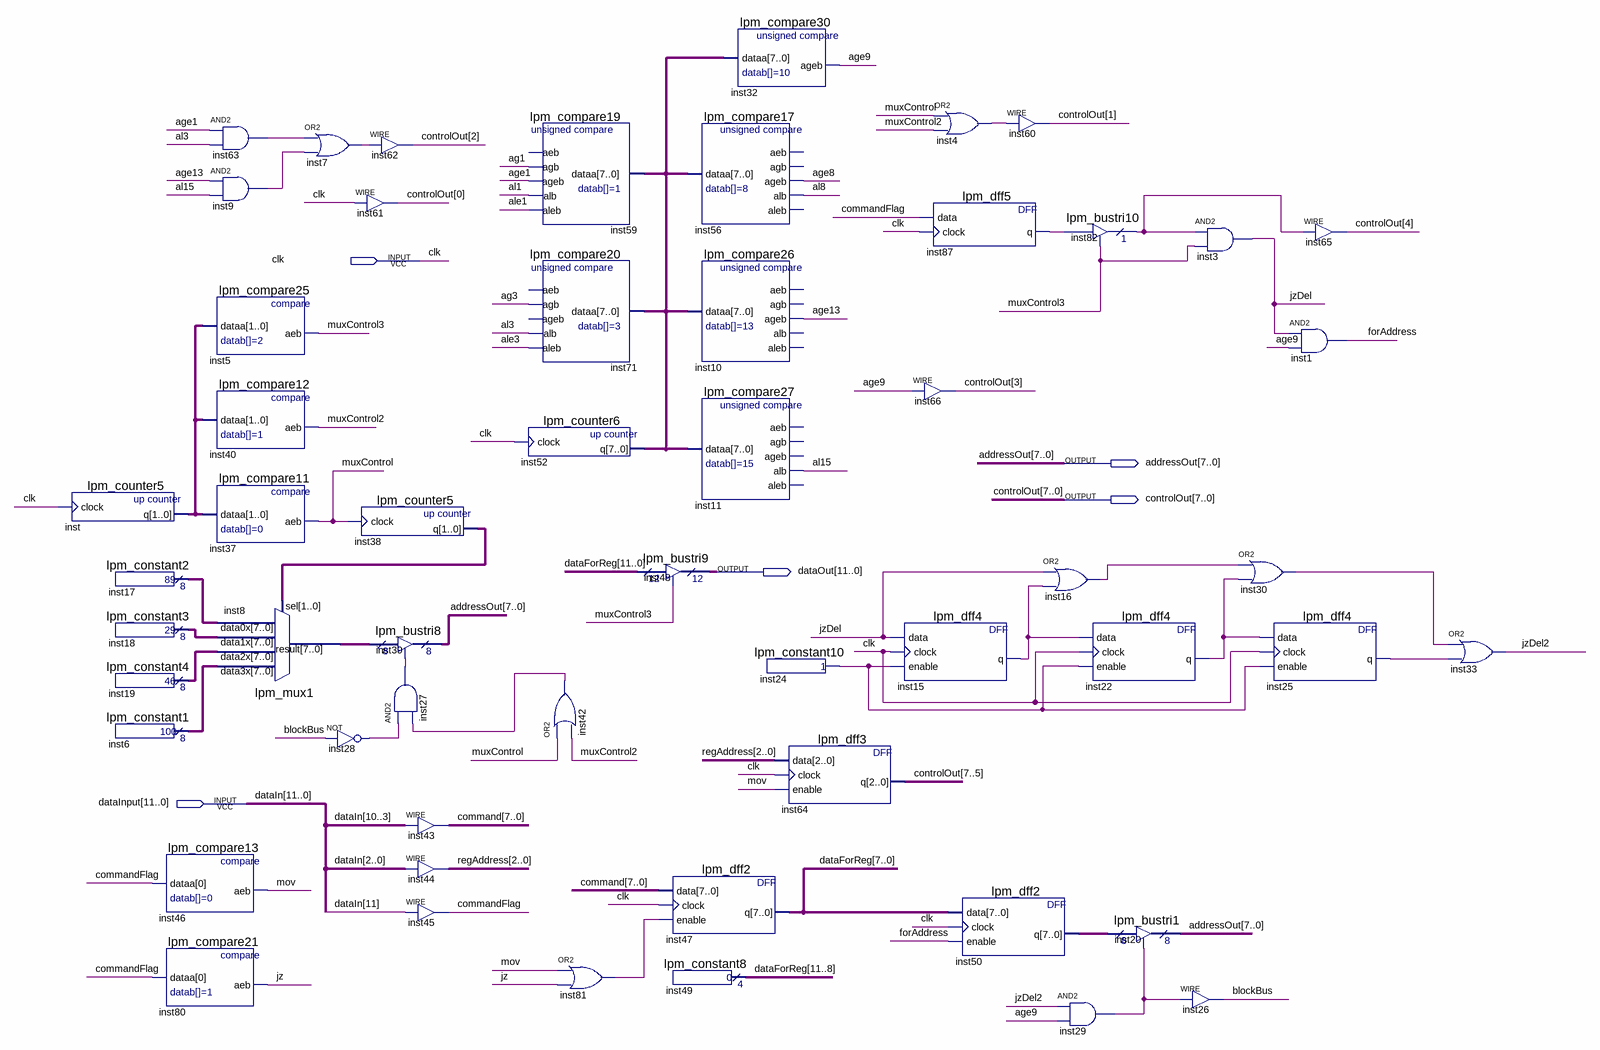
[diagram p0: schematic sheet]
// Quartus schematic ControlBlock.bdf as structural Verilog: 55 symbols, 5 pins
module ControlBlock (
  input  clk,
  input  [11:0] dataInput,
  output [7:0] addressOut,
  output [7:0] controlOut,
  output [11:0] dataOut
);

  wire ag1, ag3, age1, age8, age9, age13, al1, al3, al8, al15, ale1, ale3, blockBus, commandFlag, forAddress,
       inst4_out, inst7_out, inst9_out, inst15_q, inst16_out, inst22_q, inst24_result, inst25_q, inst27_out,
       inst28_out, inst29_out, inst30_out, inst42_out, inst63_out, inst81_out, inst82_tridata, inst87_q, jz,
       jzDel, jzDel2, mov, muxControl, muxControl2, muxControl3;
  wire [1:0] inst38_q, inst_q;
  wire [2:0] regAddress;
  wire [7:0] command, inst6_result, inst8_result, inst17_result, inst18_result, inst19_result, inst50_q,
       inst52_q;
  wire [11:0] dataForReg;

  lpm_counter5 inst (.clock(clk), .q(inst_q));
  lpm_constant2 inst17 (.result(inst17_result));
  lpm_constant3 inst18 (.result(inst18_result));
  lpm_constant4 inst19 (.result(inst19_result));
  lpm_constant1 inst6 (.result(inst6_result));
  lpm_compare13 inst46 (.dataa(commandFlag), .aeb(mov));
  lpm_compare21 inst80 (.dataa(commandFlag), .aeb(jz));
  and inst63 (inst63_out, age1, al3);
  and inst9 (inst9_out, age13, al15);
  lpm_compare25 inst5 (.dataa(inst_q), .aeb(muxControl3));
  lpm_compare12 inst40 (.dataa(inst_q), .aeb(muxControl2));
  lpm_compare11 inst37 (.dataa(inst_q), .aeb(muxControl));
  lpm_mux1 inst8 (
    .data3x(inst6_result), .data2x(inst19_result), .data1x(inst18_result), .data0x(inst17_result),
    .sel(inst38_q), .result(inst8_result));
  or inst7 (inst7_out, inst63_out, inst9_out);
  not inst28 (inst28_out, blockBus);
  assign controlOut[2] = inst7_out;  // WIRE inst62
  assign controlOut[0] = clk;  // WIRE inst61
  lpm_counter5 inst38 (.clock(muxControl), .q(inst38_q));
  lpm_bustri8 inst39 (.enabledt(inst27_out), .data(inst8_result), .tridata(addressOut));
  and inst27 (inst27_out, inst28_out, inst42_out);
  assign command = dataInput[10:3];  // WIRE inst43
  assign regAddress = dataInput[2:0];  // WIRE inst44
  assign commandFlag = dataInput[11];  // WIRE inst45
  lpm_compare19 inst59 (.dataa(inst52_q), .agb(ag1), .ageb(age1), .alb(al1), .aleb(ale1));  // open: aeb
  lpm_compare20 inst71 (.dataa(inst52_q), .agb(ag3), .alb(al3), .aleb(ale3));  // open: aeb, ageb
  lpm_counter6 inst52 (.clock(clk), .q(inst52_q));
  or inst42 (inst42_out, muxControl, muxControl2);
  or inst81 (inst81_out, mov, jz);
  lpm_bustri9 inst48 (.enabledt(muxControl3), .data(dataForReg), .tridata(dataOut));
  lpm_dff2 inst47 (.data(command), .clock(clk), .enable(inst81_out), .q(dataForReg[7:0]));
  lpm_constant8 inst49 (.result(dataForReg[11:8]));
  lpm_compare30 inst32 (.dataa(inst52_q), .ageb(age9));
  lpm_compare17 inst56 (.dataa(inst52_q), .ageb(age8), .alb(al8));  // open: aeb, agb, aleb
  lpm_compare26 inst10 (.dataa(inst52_q), .ageb(age13));  // open: aeb, agb, alb, aleb
  lpm_compare27 inst11 (.dataa(inst52_q), .alb(al15));  // open: aeb, agb, ageb, aleb
  lpm_constant10 inst24 (.result(inst24_result));
  lpm_dff3 inst64 (.data(regAddress), .clock(clk), .enable(mov), .q(controlOut[7:5]));
  lpm_dff4 inst15 (.data(jzDel), .clock(clk), .enable(inst24_result), .q(inst15_q));
  or inst4 (inst4_out, muxControl, muxControl2);
  lpm_dff5 inst87 (.data(commandFlag), .clock(clk), .q(inst87_q));
  assign controlOut[3] = age9;  // WIRE inst66
  lpm_dff2 inst50 (.data(dataForReg[7:0]), .clock(clk), .enable(forAddress), .q(inst50_q));
  assign controlOut[1] = inst4_out;  // WIRE inst60
  lpm_bustri10 inst82 (.enabledt(muxControl3), .data(inst87_q), .tridata(inst82_tridata));
  or inst16 (inst16_out, jzDel, inst15_q);
  lpm_dff4 inst22 (.data(inst15_q), .clock(clk), .enable(inst24_result), .q(inst22_q));
  and inst29 (inst29_out, jzDel2, age9);
  lpm_bustri1 inst20 (.enabledt(inst29_out), .data(inst50_q), .tridata(addressOut));
  and inst3 (jzDel, inst82_tridata, muxControl3);
  assign blockBus = inst29_out;  // WIRE inst26
  or inst30 (inst30_out, inst16_out, inst22_q);
  assign controlOut[4] = inst82_tridata;  // WIRE inst65
  and inst1 (forAddress, jzDel, age9);
  lpm_dff4 inst25 (.data(inst22_q), .clock(clk), .enable(inst24_result), .q(inst25_q));
  or inst33 (jzDel2, inst30_out, inst25_q);

  // Other names for the same wires on the sheet: dataIn[11:0] = dataInput
endmodule
